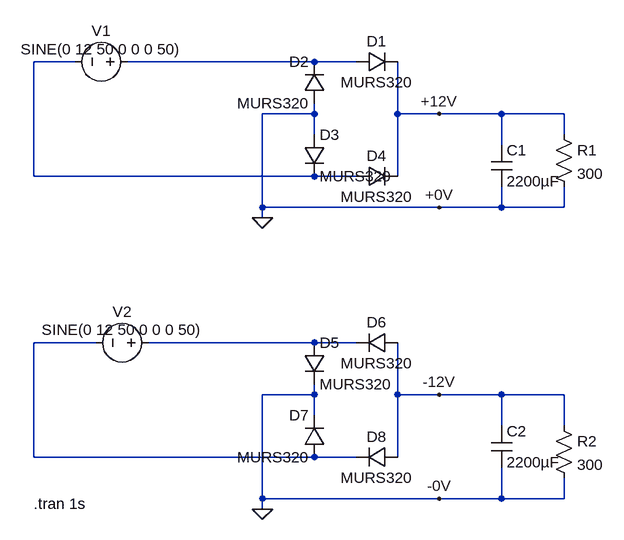
[diagram p0: schematic PowerSupply.asc]
PowerSupply.asc, the LTspice schematic file:
Version 4
SHEET 1 880 692
WIRE -368 -32 -432 -32
WIRE 0 -32 -288 -32
WIRE 64 -32 0 -32
WIRE 0 48 0 32
WIRE 0 48 -80 48
WIRE 128 48 128 -32
WIRE 192 48 128 48
WIRE 288 48 192 48
WIRE 384 48 288 48
WIRE 0 80 0 48
WIRE 384 80 384 48
WIRE 288 96 288 48
WIRE -432 144 -432 -32
WIRE 0 144 -432 144
WIRE 64 144 0 144
WIRE 128 144 128 48
WIRE -80 192 -80 48
WIRE 192 192 -80 192
WIRE 288 192 288 160
WIRE 288 192 192 192
WIRE 384 192 384 160
WIRE 384 192 288 192
WIRE -80 208 -80 192
WIRE -336 400 -432 400
WIRE 0 400 -256 400
WIRE 64 400 0 400
WIRE 0 480 0 464
WIRE 0 480 -80 480
WIRE 128 480 128 400
WIRE 192 480 128 480
WIRE 288 480 192 480
WIRE 384 480 288 480
WIRE 0 512 0 480
WIRE 288 528 288 480
WIRE 384 528 384 480
WIRE -432 576 -432 400
WIRE 0 576 -432 576
WIRE 64 576 0 576
WIRE 128 576 128 480
WIRE -80 640 -80 480
WIRE 192 640 -80 640
WIRE 288 640 288 592
WIRE 288 640 192 640
WIRE 384 640 384 608
WIRE 384 640 288 640
WIRE -80 656 -80 640
FLAG -80 656 0
FLAG 192 48 +12V
FLAG 192 480 -12V
FLAG 192 640 -0V
FLAG 192 192 +0V
FLAG -80 208 0
SYMBOL voltage -272 -32 R90
WINDOW 0 -32 56 VBottom 2
WINDOW 3 -4 56 VBottom 2
WINDOW 123 -4 56 VBottom 2
WINDOW 39 0 0 Left 2
SYMATTR InstName V1
SYMATTR Value SINE(0 12 50 0 0 0 50)
SYMBOL diode 16 32 R180
WINDOW 0 24 64 Left 2
WINDOW 3 24 0 Left 2
SYMATTR InstName D2
SYMATTR Value MURS320
SYMBOL diode 64 -16 R270
WINDOW 0 32 32 VTop 2
WINDOW 3 0 32 VBottom 2
SYMATTR InstName D1
SYMATTR Value MURS320
SYMBOL diode -16 80 R0
SYMATTR InstName D3
SYMATTR Value MURS320
SYMBOL diode 64 160 R270
WINDOW 0 32 32 VTop 2
WINDOW 3 0 32 VBottom 2
SYMATTR InstName D4
SYMATTR Value MURS320
SYMBOL diode -16 400 R0
SYMATTR InstName D5
SYMATTR Value MURS320
SYMBOL diode 128 384 R90
WINDOW 0 0 32 VBottom 2
WINDOW 3 32 32 VTop 2
SYMATTR InstName D6
SYMATTR Value MURS320
SYMBOL diode 16 576 R180
WINDOW 0 24 64 Left 2
WINDOW 3 24 0 Left 2
SYMATTR InstName D7
SYMATTR Value MURS320
SYMBOL diode 128 560 R90
WINDOW 0 0 32 VBottom 2
WINDOW 3 32 32 VTop 2
SYMATTR InstName D8
SYMATTR Value MURS320
SYMBOL res 368 512 R0
SYMATTR InstName R2
SYMATTR Value 300
SYMBOL voltage -240 400 R90
WINDOW 0 -32 56 VBottom 2
WINDOW 3 -4 56 VBottom 2
WINDOW 123 -4 56 VBottom 2
WINDOW 39 0 0 Left 2
SYMATTR InstName V2
SYMATTR Value SINE(0 12 50 0 0 0 50)
SYMBOL res 368 64 R0
SYMATTR InstName R1
SYMATTR Value 300
SYMBOL cap 272 96 R0
SYMATTR InstName C1
SYMATTR Value 2200µF
SYMATTR SpiceLine Rser=0,1
SYMBOL cap 272 528 R0
SYMATTR InstName C2
SYMATTR Value 2200µF
SYMATTR SpiceLine Rser=0.1
TEXT -432 648 Left 2 !.tran 1s

The netlist it stands for:
* PowerSupply.asc
V1 N002 N001 SINE(0 12 50 0 0 0 50)
D2 0 N002 MURS320
D1 N002 +12V MURS320
D3 0 N001 MURS320
D4 N001 +12V MURS320
D5 N004 0 MURS320
D6 -12V N004 MURS320
D7 N003 0 MURS320
D8 -12V N003 MURS320
R2 -12V 0 300
V2 N004 N003 SINE(0 12 50 0 0 0 50)
R1 +12V 0 300
C1 +12V 0 2200µF Rser=0,1
C2 -12V 0 2200µF Rser=0.1
.model D D
.lib standard.dio
.tran 1s
.backanno
.end

* Results of the author's LTspice run, read from the files saved beside the schematic
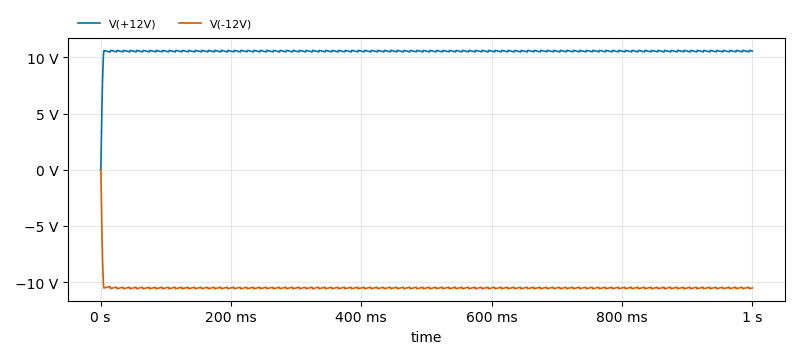
[diagram p1: Transient Analysis of PowerSupply.asc, plotted from the saved traces]
* Transient Analysis, 1 run:
*   V(+12V): min 0 V, max 10.63 V, average 10.53 V, rms 10.54 V, last 10.56 V
*   V(-12V): min -10.6 V, max 0 V, average -10.51 V, rms 10.51 V, last -10.52 V